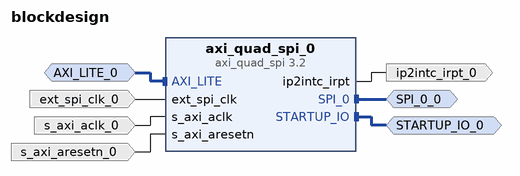
[diagram p0: block diagram of the top level]
# Vivado block design blockdesign, xc7a200tfbg676-2, Vivado 2023.2
create_bd_design blockdesign

create_bd_intf_port -mode Master -vlnv xilinx.com:interface:spi_rtl:1.0 SPI_0_0
create_bd_intf_port -mode Master -vlnv xilinx.com:display_startup_io:startup_io_rtl:1.0 STARTUP_IO_0
create_bd_intf_port -mode Slave -vlnv xilinx.com:interface:aximm_rtl:1.0 AXI_LITE_0
set_property -dict [list \
  CONFIG.ADDR_WIDTH 7 \
  CONFIG.ARUSER_WIDTH 0 \
  CONFIG.AWUSER_WIDTH 0 \
  CONFIG.BUSER_WIDTH 0 \
  CONFIG.DATA_WIDTH 32 \
  CONFIG.HAS_BRESP 1 \
  CONFIG.HAS_BURST 0 \
  CONFIG.HAS_CACHE 0 \
  CONFIG.HAS_LOCK 0 \
  CONFIG.HAS_PROT 0 \
  CONFIG.HAS_QOS 0 \
  CONFIG.HAS_REGION 0 \
  CONFIG.HAS_RRESP 1 \
  CONFIG.HAS_WSTRB 1 \
  CONFIG.ID_WIDTH 0 \
  CONFIG.MAX_BURST_LENGTH 1 \
  CONFIG.NUM_READ_OUTSTANDING 1 \
  CONFIG.NUM_READ_THREADS 1 \
  CONFIG.NUM_WRITE_OUTSTANDING 1 \
  CONFIG.NUM_WRITE_THREADS 1 \
  CONFIG.PROTOCOL AXI4LITE \
  CONFIG.READ_WRITE_MODE READ_WRITE \
  CONFIG.RUSER_BITS_PER_BYTE 0 \
  CONFIG.RUSER_WIDTH 0 \
  CONFIG.SUPPORTS_NARROW_BURST 0 \
  CONFIG.WUSER_BITS_PER_BYTE 0 \
  CONFIG.WUSER_WIDTH 0 \
] [get_bd_intf_ports AXI_LITE_0]
create_bd_port -dir O -type intr ip2intc_irpt_0
create_bd_port -dir I -type clk ext_spi_clk_0
create_bd_port -dir I -type clk s_axi_aclk_0
create_bd_port -dir I -type rst s_axi_aresetn_0

create_bd_cell -type ip -vlnv xilinx.com:ip:axi_quad_spi:3.2 axi_quad_spi_0
set_property -dict {CONFIG.QSPI_BOARD_INTERFACE spi_flash CONFIG.USE_BOARD_FLOW true} [get_bd_cells axi_quad_spi_0]

# ---- connections ----

connect_bd_intf_net -intf_net AXI_LITE_0_1 [get_bd_intf_ports AXI_LITE_0] [get_bd_intf_pins axi_quad_spi_0/AXI_LITE]
connect_bd_intf_net [get_bd_intf_ports SPI_0_0] [get_bd_intf_pins axi_quad_spi_0/SPI_0]
connect_bd_intf_net [get_bd_intf_ports STARTUP_IO_0] [get_bd_intf_pins axi_quad_spi_0/STARTUP_IO]
connect_bd_net [get_bd_pins axi_quad_spi_0/ip2intc_irpt] [get_bd_ports ip2intc_irpt_0]
connect_bd_net -net ext_spi_clk_0_1 [get_bd_ports ext_spi_clk_0] [get_bd_pins axi_quad_spi_0/ext_spi_clk]
connect_bd_net -net s_axi_aclk_0_1 [get_bd_ports s_axi_aclk_0] [get_bd_pins axi_quad_spi_0/s_axi_aclk]
connect_bd_net -net s_axi_aresetn_0_1 [get_bd_ports s_axi_aresetn_0] [get_bd_pins axi_quad_spi_0/s_axi_aresetn]

validate_bd_design
save_bd_design
